# Altium schematic sheet 24V_Main_Regulator.SchDoc (part 4 of 5)
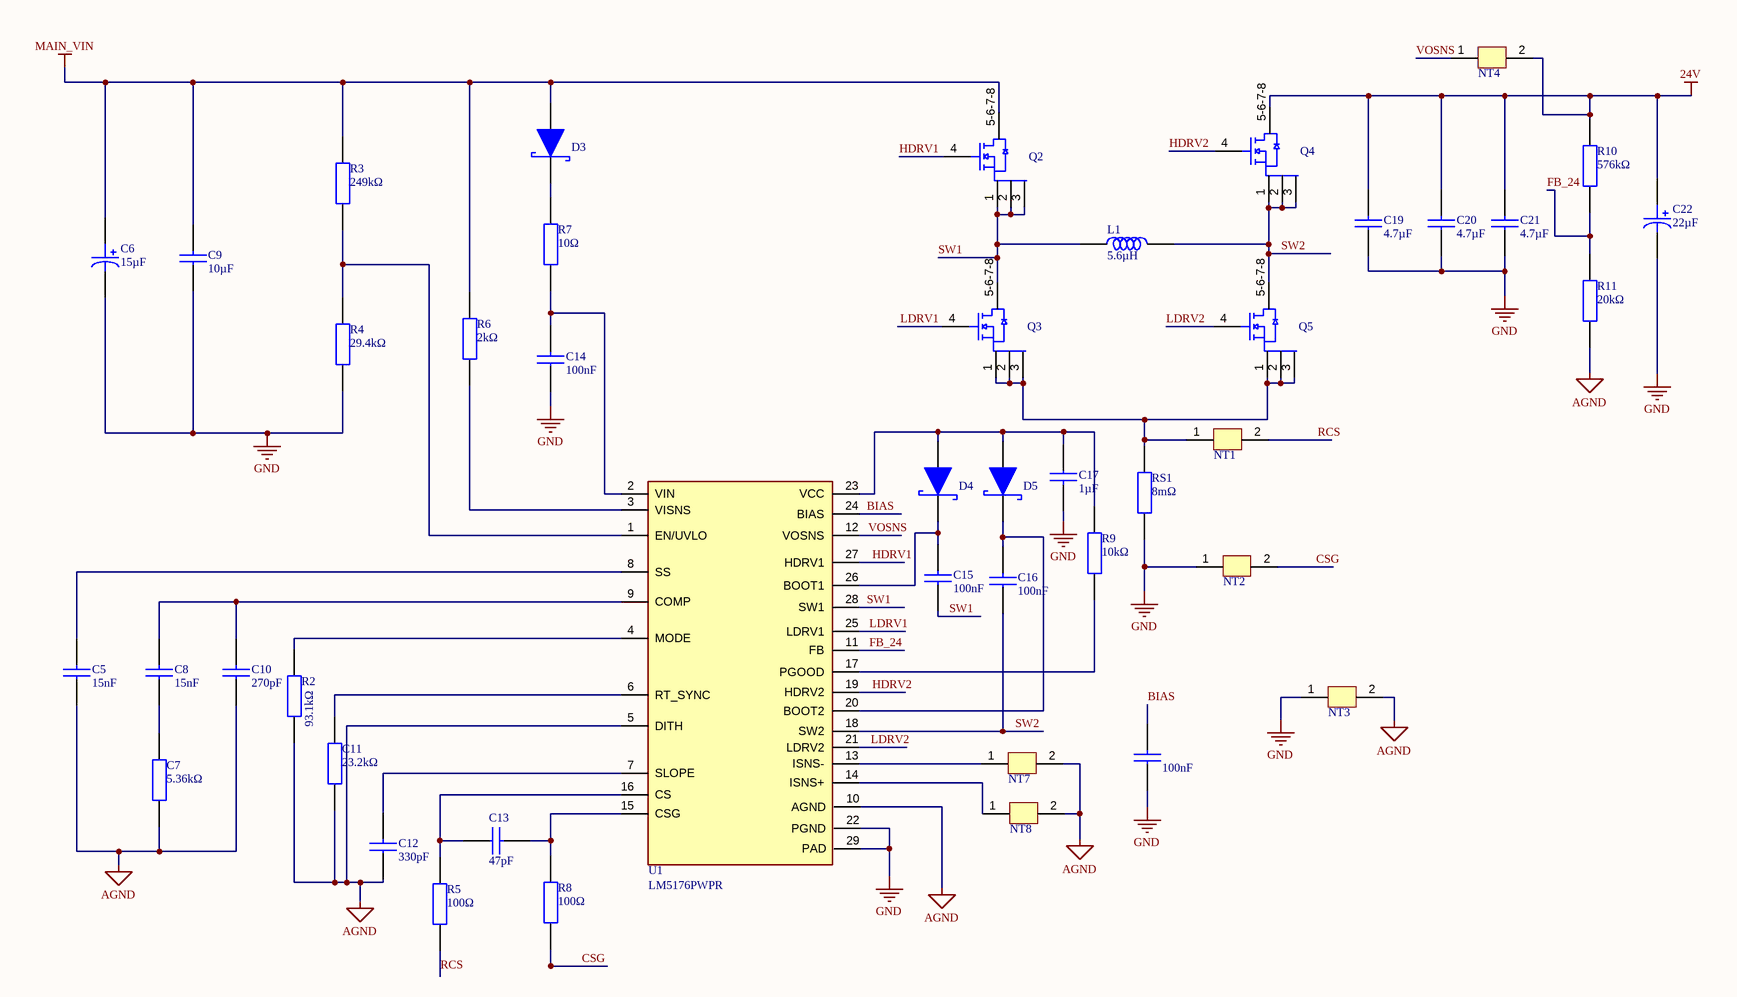
[diagram p3: 24V_Main_Regulator.SchDoc]

## Library data of the parts (continued)
Q4 = CSD18540Q5B: 60-V, N channel NexFET™ power MOSFET, single SON 5 mm x 6 mm, 2.2 mOhm 8-VSON-CLIP -55 to 175; Manufacturer: Texas Instruments; Manufacturer Lifecycle Status: ACTIVE; Continuous Drain Current (ID): 29A; Drain to Source Resistance: 1.8mΩ; Drain to Source Voltage (Vdss): 60V; Fall Time: 3ns; Gate to Source Voltage (Vgs): 20V; Input Capacitance: 4.23nF; Max Junction Temperature (Tj): 175°C; Max Power Dissipation: 3.1W; Number of Channels: 1; Power Dissipation: 3.8W; Rds On Max: 2.2mΩ; Rise Time: 9ns; Turn-Off Delay Time: 20ns; Turn-On Delay Time: 6ns; Supplier: Arrow Electronics; Supplier Part Number: CSD18540Q5B; Manufacturer Part Number: CSD18540Q5B; RoHS: Compliant; Category: MOSFETs; Stock: 867; Pricing: 1=2,6866, 10=1,8382, 25=1,8215, 100=1,293, 250=1,2821, 500=1,0204 (USD); Contact Plating: Gold; Element Configuration: Single; Height: 0m; Lead Free: Contains Lead; Length: 5mm; Lifecycle Status: Production; Max Operating Temperature: 175°C; Min Operating Temperature: -55°C; Mounting Technology: Surface Mount; Pins: 8; Packaging: Tape & Reel (TR); Schedule B: 8541290080, 8541290080|8541290080|8541290080|8541290080|8541290080; Thickness: 950µm; Width: 5mm; ComponentLink1URL: https://datasheet.octopart.com:443/CSD18540Q5B-Texas-Instruments-datasheet-41215267.pdf?src-supplier=Texas+Instruments; ComponentLink1Description: https://datasheet.octopart.com:443/CSD18540Q5B-Texas-Instruments-datasheet-41215267.pdf?src-supplier=Texas+Instruments; ComponentLink2URL: https://octopart.com:443/opatz8j6/c1?t=SUskelIlBWIo_nWBJiAx1_ldGWU3oeiOn-EJs-5do1YusiS-JDvlKRrouVl-Y20ao-5z_08mEvz_AeJefeF_pOrLs0WfjhDJ2_xgnnOXWDpra4Cd3mKzckoQ6QanCMAXyB-vVCGNjBMeeyDAJ_8AtgWzG5J-VV0M2AC15IA14uOxBYYbIO1uRZi3YsibPr8OpLgj2-g8ey3MShCBBxtcPxAJXU9zClIpSD2jte82BFzbVJ9hhAzdJsrLZ3RNwxiUfmRI5v2vfH2Xq2tWnkVJNmbpw4R6VYt-2jb8TG9SzpqJvWz5ux_mibd2tkPbQSuE4I96mnLqjONPYMf24_myiaENOmBZXsZhO5Lu3rDJDhrEeNYScROBq6ZJRXBJXpuxfZxAZ_Uv9q79&src-supplier=Texas+Instruments; ComponentLink2Description: https://octopart.com:443/opatz8j6/c1?t=SUskelIlBWIo_nWBJiAx1_ldGWU3oeiOn-EJs-5do1YusiS-JDvlKRrouVl-Y20ao-5z_08mEvz_AeJefeF_pOrLs0WfjhDJ2_xgnnOXWDpra4Cd3mKzckoQ6QanCMAXyB-vVCGNjBMeeyDAJ_8AtgWzG5J-VV0M2AC15IA14uOxBYYbIO1uRZi3YsibPr8OpLgj2-g8ey3MShCBBxtcPxAJXU9zClIpSD2jte82BFzbVJ9hhAzdJsrLZ3RNwxiUfmRI5v2vfH2Xq2tWnkVJNmbpw4R6VYt-2jb8TG9SzpqJvWz5ux_mibd2tkPbQSuE4I96mnLqjONPYMf24_myiaENOmBZXsZhO5Lu3rDJDhrEeNYScROBq6ZJRXBJXpuxfZxAZ_Uv9q79&src-supplier=Texas+Instruments; ComponentLink3URL: https://datasheet.octopart.com:443/CSD18540Q5B-Texas-Instruments-datasheet-27303987.pdf?src-supplier=Texas+Instruments; ComponentLink3Description: https://datasheet.octopart.com:443/CSD18540Q5B-Texas-Instruments-datasheet-27303987.pdf?src-supplier=Texas+Instruments; ComponentLink4URL: https://datasheet.octopart.com:443/CSD18540Q5B-Texas-Instruments-datasheet-145028107.pdf?src-supplier=Arrow.cn; ComponentLink4Description: https://datasheet.octopart.com:443/CSD18540Q5B-Texas-Instruments-datasheet-145028107.pdf?src-supplier=Arrow.cn; ComponentLink5URL: http://sigma.octopart.com:80/reach_statement/Texas-Instruments-company-64.pdf?src-supplier=Compliance+Statements; ComponentLink5Description: http://sigma.octopart.com:80/reach_statement/Texas-Instruments-company-64.pdf?src-supplier=Compliance+Statements; ComponentLink6URL: http://sigma.octopart.com:80/conflict_mineral_statement/Texas-Instruments-company-63.pdf?src-supplier=Compliance+Statements; ComponentLink6Description: http://sigma.octopart.com:80/conflict_mineral_statement/Texas-Instruments-company-63.pdf?src-supplier=Compliance+Statements
Q5 = CSD18531Q5A: 60-V, N channel NexFET™ power MOSFET, single SON 5 mm x 6 mm, 4.6 mOhm 8-VSONP -55 to 150; Manufacturer: Texas Instruments; Manufacturer Part Number: CSD18531Q5AT; Manufacturer Lifecycle Status: ACTIVE; Continuous Drain Current (ID): 19A; Drain to Source Breakdown Voltage: 60V; Drain to Source Resistance: 3.5mΩ; Fall Time: 2.7ns; Gate to Source Voltage (Vgs): 20V; Input Capacitance: 3.84nF; Max Junction Temperature (Tj): 175°C; Max Power Dissipation: 3.1W; Number of Channels: 1; Power Dissipation: 3.8W; Rds On Max: 4.6mΩ; Value: 3.5mΩ; Rise Time: 7.8ns; Turn-Off Delay Time: 20ns; Turn-On Delay Time: 4.4ns; Supplier: Arrow Electronics; Supplier Part Number: CSD18531Q5AT; RoHS: Compliant; Category: MOSFETs; Pricing: 250=0,8338 (USD); Contact Plating: Tin; Drain to Source Voltage (Vdss): 60V; Element Configuration: Single; Height: 1.1mm; Lead Free: Contains Lead; Length: 4.9mm; Lifecycle Status: Production; Max Operating Temperature: 150°C; Min Operating Temperature: -55°C; Mounting Technology: Surface Mount; Pins: 8; Packaging: Tape & Reel (TR); Schedule B: 8541290080, 8541290080|8541290080|8541290080|8541290080|8541290080; Thickness: 1mm; Width: 6mm; ComponentLink1URL: https://sigma.octopart.com:443/184372194/technical_drawing/Texas-Instruments-CSD18531Q5AT.pdf?src-supplier=Texas+Instruments; ComponentLink1Description: https://sigma.octopart.com:443/184372194/technical_drawing/Texas-Instruments-CSD18531Q5AT.pdf?src-supplier=Texas+Instruments; ComponentLink2URL: https://octopart.com:443/opatz8j6/c1?t=W2rgiyD8EjdRm1lOlBGoi7T6EEwWZbXWrvnEMGu-A6b8yCru-_x-ioUheIPm0hxZEgjghIgVtPE7G2yaPvvywfBu5e_gdtPPfVxi3_MN2KaDnaFHT6eOwBCucXVzfSMTayYIqoRMHLEh-JgOuNfv0A0EbM76JoV5YlW5CScQnzkUGicMF0MVaNH8qV9Xa8SEM2jbnuuMLUncsLlJ2Nh_6_HcvYALWEcpw-1ynH0F38U8j3r_BkZDi93FTevgE5QOgVnjDW5Tb2x-_jnB4s8BDtSwP8ocS-5RH8orsDAZrGiujDbFgbWPSiX966ts_AoMkv91lGcKW3xUpcpSdzRQwiT4IIdsP0R0j06tuTnbm32eNkMYCAe8Y2R0e9qZlXzEIumhKZZtVvlT&src-supplier=Texas+Instruments; ComponentLink2Description: https://octopart.com:443/opatz8j6/c1?t=W2rgiyD8EjdRm1lOlBGoi7T6EEwWZbXWrvnEMGu-A6b8yCru-_x-ioUheIPm0hxZEgjghIgVtPE7G2yaPvvywfBu5e_gdtPPfVxi3_MN2KaDnaFHT6eOwBCucXVzfSMTayYIqoRMHLEh-JgOuNfv0A0EbM76JoV5YlW5CScQnzkUGicMF0MVaNH8qV9Xa8SEM2jbnuuMLUncsLlJ2Nh_6_HcvYALWEcpw-1ynH0F38U8j3r_BkZDi93FTevgE5QOgVnjDW5Tb2x-_jnB4s8BDtSwP8ocS-5RH8orsDAZrGiujDbFgbWPSiX966ts_AoMkv91lGcKW3xUpcpSdzRQwiT4IIdsP0R0j06tuTnbm32eNkMYCAe8Y2R0e9qZlXzEIumhKZZtVvlT&src-supplier=Texas+Instruments; ComponentLink3URL: https://sigma.octopart.com:443/183468693/technical_drawing/Texas-Instruments-CSD18531Q5AT.pdf?src-supplier=Texas+Instruments; ComponentLink3Description: https://sigma.octopart.com:443/183468693/technical_drawing/Texas-Instruments-CSD18531Q5AT.pdf?src-supplier=Texas+Instruments; ComponentLink4URL: https://datasheet.octopart.com:443/CSD18531Q5AT-Texas-Instruments-datasheet-41215258.pdf?src-supplier=Texas+Instruments; ComponentLink4Description: https://datasheet.octopart.com:443/CSD18531Q5AT-Texas-Instruments-datasheet-41215258.pdf?src-supplier=Texas+Instruments; ComponentLink5URL: https://datasheet.octopart.com:443/CSD18531Q5AT-Texas-Instruments-datasheet-38229661.pdf?src-supplier=Texas+Instruments; ComponentLink5Description: https://datasheet.octopart.com:443/CSD18531Q5AT-Texas-Instruments-datasheet-38229661.pdf?src-supplier=Texas+Instruments; ComponentLink6URL: https://datasheet.octopart.com:443/CSD18531Q5AT-Texas-Instruments-datasheet-153410981.pdf?src-supplier=Upverter; ComponentLink6Description: https://datasheet.octopart.com:443/CSD18531Q5AT-Texas-Instruments-datasheet-153410981.pdf?src-supplier=Upverter; ComponentLink7URL: https://datasheet.octopart.com:443/CSD18531Q5AT-Texas-Instruments-datasheet-163657923.pdf?src-supplier=Augswan; ComponentLink7Description: https://datasheet.octopart.com:443/CSD18531Q5AT-Texas-Instruments-datasheet-163657923.pdf?src-supplier=Augswan; ComponentLink8URL: https://datasheet.octopart.com:443/CSD18531Q5AT-Texas-Instruments-datasheet-97084065.pdf?src-supplier=TME; ComponentLink8Description: https://datasheet.octopart.com:443/CSD18531Q5AT-Texas-Instruments-datasheet-97084065.pdf?src-supplier=TME; ComponentLink9URL: https://datasheet.octopart.com:443/CSD18531Q5AT-Texas-Instruments-datasheet-140571312.pdf?src-supplier=Arrow.cn; ComponentLink9Description: https://datasheet.octopart.com:443/CSD18531Q5AT-Texas-Instruments-datasheet-140571312.pdf?src-supplier=Arrow.cn; ComponentLink10URL: https://datasheet.octopart.com:443/CSD18531Q5AT-Texas-Instruments-datasheet-62088669.pdf?src-supplier=Newark; ComponentLink10Description: https://datasheet.octopart.com:443/CSD18531Q5AT-Texas-Instruments-datasheet-62088669.pdf?src-supplier=Newark; ComponentLink11URL: https://datasheet.octopart.com:443/CSD18531Q5AT-Texas-Instruments-datasheet-44402567.pdf?src-supplier=Newark; ComponentLink11Description: https://datasheet.octopart.com:443/CSD18531Q5AT-Texas-Instruments-datasheet-44402567.pdf?src-supplier=Newark; ComponentLink12URL: http://sigma.octopart.com:80/reach_statement/Texas-Instruments-company-64.pdf?src-supplier=Compliance+Statements; ComponentLink12Description: http://sigma.octopart.com:80/reach_statement/Texas-Instruments-company-64.pdf?src-supplier=Compliance+Statements; ComponentLink13URL: http://sigma.octopart.com:80/conflict_mineral_statement/Texas-Instruments-company-63.pdf?src-supplier=Compliance+Statements; ComponentLink13Description: http://sigma.octopart.com:80/conflict_mineral_statement/Texas-Instruments-company-63.pdf?src-supplier=Compliance+Statements
R2 = RC0603FR-0793K1L: Res Thick Film 0603 93.1K Ohm 1% 0.1W(1/10W) ±100ppm/C Pad SMD T/R; Manufacturer: Yageo Group; Max Power Dissipation: 100mW; Temperature Coefficient: 100ppm/°C; Voltage Rating: 75V; Voltage Rating (DC): 50V; Supplier: Farnell; Supplier Part Number: RC0603FR-0793K1L; Manufacturer Part Number: RC0603FR-0793K1L; RoHS: Compliant; Category: Chip SMD Resistors; Stock: 4877; Pricing: 10=0,0061, 100=0,0052, 500=0,0049, 1000=0,0046, 2500=0,0036 (EUR); Case/Package: 0603; Case Code (Imperial): 0603; China RoHS: Non-Compliant; Composition: Thick Film; Contact Plating: Tin; Depth: 800µm; Features: Moisture Resistant; Height: 450µm; Lead Free: Lead Free; Length: 1.6mm; Lifecycle Status: Production; Max Operating Temperature: 155°C; Military Standard: Not; Min Operating Temperature: -55°C; Mounting Technology: Surface Mount; Number of Terminals: 2; Number of Terminations: 2; Packaging: Tape & Reel; Power Rating: 100mW; Radiation Hardening: No; REACH SVHC: Yes; Schedule B: 8533210045, 8533210045|8533210045|8533210045|8533210045|8533210045; Termination: SMD/SMT; Tolerance: 1%; Width: 800µm; Working Voltage: 75V; ComponentLink1URL: https://datasheet.octopart.com:443/RC0603FR-0793K1L-Yageo-datasheet-175887523.pdf?src-supplier=Newark; ComponentLink1Description: https://datasheet.octopart.com:443/RC0603FR-0793K1L-Yageo-datasheet-175887523.pdf?src-supplier=Newark; ComponentLink2URL: https://datasheet.octopart.com:443/RC0603FR-0793K1L-Yageo-datasheet-103092701.pdf?src-supplier=Upverter; ComponentLink2Description: https://datasheet.octopart.com:443/RC0603FR-0793K1L-Yageo-datasheet-103092701.pdf?src-supplier=Upverter; ComponentLink3URL: https://datasheet.octopart.com:443/RC0603FR-0793K1L-Yageo-datasheet-8328172.pdf?src-supplier=_legacy+Avnet; ComponentLink3Description: https://datasheet.octopart.com:443/RC0603FR-0793K1L-Yageo-datasheet-8328172.pdf?src-supplier=_legacy+Avnet; ComponentLink4URL: https://datasheet.octopart.com:443/RC0603FR-0793K1L-Yageo-Group-datasheet-176638170.pdf?src-supplier=Future+Electronics; ComponentLink4Description: https://datasheet.octopart.com:443/RC0603FR-0793K1L-Yageo-Group-datasheet-176638170.pdf?src-supplier=Future+Electronics; ComponentLink5URL: https://datasheet.octopart.com:443/RC0603FR-0793K1L-Yageo-datasheet-164759695.pdf?src-supplier=Future+Electronics; ComponentLink5Description: https://datasheet.octopart.com:443/RC0603FR-0793K1L-Yageo-datasheet-164759695.pdf?src-supplier=Future+Electronics; ComponentLink6URL: https://datasheet.octopart.com:443/RC0603FR-0793K1L-Yageo-datasheet-137700087.pdf?src-supplier=Future+Electronics; ComponentLink6Description: https://datasheet.octopart.com:443/RC0603FR-0793K1L-Yageo-datasheet-137700087.pdf?src-supplier=Future+Electronics; ComponentLink7URL: https://datasheet.octopart.com:443/RC0603FR-0793K1L-Yageo-datasheet-15599030.pdf?src-supplier=Future+Electronics; ComponentLink7Description: https://datasheet.octopart.com:443/RC0603FR-0793K1L-Yageo-datasheet-15599030.pdf?src-supplier=Future+Electronics; ComponentLink8URL: https://datasheet.octopart.com:443/RC0603FR-0793K1L-Yageo-datasheet-12596169.pdf?src-supplier=Future+Electronics; ComponentLink8Description: https://datasheet.octopart.com:443/RC0603FR-0793K1L-Yageo-datasheet-12596169.pdf?src-supplier=Future+Electronics; ComponentLink9URL: https://datasheet.octopart.com:443/RC0603FR-0793K1L-Yageo-datasheet-79472498.pdf?src-supplier=Megastar; ComponentLink9Description: https://datasheet.octopart.com:443/RC0603FR-0793K1L-Yageo-datasheet-79472498.pdf?src-supplier=Megastar; ComponentLink10URL: https://datasheet.octopart.com/RC0603FR-0793K1L-Yageo-datasheet-73766026.pdf; ComponentLink10Description: https://datasheet.octopart.com/RC0603FR-0793K1L-Yageo-datasheet-73766026.pdf; ComponentLink11URL: https://datasheet.octopart.com:443/RC0603FR-0793K1L-Yageo-datasheet-118562.pdf?src-supplier=DigiKey; ComponentLink11Description: https://datasheet.octopart.com:443/RC0603FR-0793K1L-Yageo-datasheet-118562.pdf?src-supplier=DigiKey; ComponentLink12URL: http://sigma.octopart.com:80/conflict_mineral_statement/Yageo-company-3.pdf?src-supplier=Compliance+Statements; ComponentLink12Description: http://sigma.octopart.com:80/conflict_mineral_statement/Yageo-company-3.pdf?src-supplier=Compliance+Statements; ComponentLink13URL: http://sigma.octopart.com:80/rohs_statement/Yageo-company-2.pdf?src-supplier=Compliance+Statements; ComponentLink13Description: http://sigma.octopart.com:80/rohs_statement/Yageo-company-2.pdf?src-supplier=Compliance+Statements
R3 = CRCW0402249KFKED: Fixed Resistor, Metal Glaze/Thick Film, 0.063W, 249000ohm, 50V, 1% +/-Tol, Surface Mount, 0402; Manufacturer: Vishay; Max Power Dissipation: 63mW; Temperature Coefficient: 100ppm/°C; Supplier: Farnell; Supplier Part Number: CRCW0402249KFKED; Manufacturer Part Number: CRCW0402249KFKED; RoHS: Compliant; Category: Chip SMD Resistors; Stock: 14076; Pricing: 10=0,02, 100=0,0145, 500=0,0117, 2500=0,0097, 5000=0,0095 (EUR); Case/Package: 0402; Case Code (Imperial): 0402; China RoHS: Non-Compliant; Composition: Thick Film; Contact Plating: Tin; Depth: 500µm; Features: Automotive AEC-Q200; Height: 350µm; Lead Free: Lead Free; Length: 1mm; Lifecycle Status: Production; Max Operating Temperature: 155°C; Military Standard: Not; Min Operating Temperature: -55°C; Mounting Technology: Surface Mount; Pins: 2; Number of Terminals: 2; Number of Terminations: 2; Packaging: Cut Tape; Power Rating: 63mW; Ratings: AEC-Q200; REACH SVHC: Yes; Schedule B: 8533210045, 8533210045|8533210045|8533210045|8533210045|8533210045|8533210045|8533210045|8533210045|8533210045|8533210045|8533210045|8533210045|8533210045|8533210045|8533210045|8533210045|8533210045|8533210045|8533210045|8533210045|8533210045|8533210045|8533210045|85; Termination: SMD/SMT; Tolerance: 1%; Voltage Rating: 50V; Voltage Rating (DC): 50V; Weight: 652.039032µg; Width: 500µm; Working Voltage: 50V; ComponentLink1URL: https://datasheet.octopart.com:443/CRCW0402249KFKED-Vishay-datasheet-175423584.pdf?src-supplier=IHS; ComponentLink1Description: https://datasheet.octopart.com:443/CRCW0402249KFKED-Vishay-datasheet-175423584.pdf?src-supplier=IHS; ComponentLink2URL: https://datasheet.octopart.com:443/CRCW0402249KFKED-Vishay-datasheet-83961561.pdf?src-supplier=element14+APAC; ComponentLink2Description: https://datasheet.octopart.com:443/CRCW0402249KFKED-Vishay-datasheet-83961561.pdf?src-supplier=element14+APAC; ComponentLink3URL: https://datasheet.octopart.com:443/CRCW0402249KFKED-Vishay-datasheet-62317933.pdf?src-supplier=element14+APAC; ComponentLink3Description: https://datasheet.octopart.com:443/CRCW0402249KFKED-Vishay-datasheet-62317933.pdf?src-supplier=element14+APAC; ComponentLink4URL: https://datasheet.octopart.com:443/CRCW0402249KFKED-Vishay-datasheet-14722531.pdf?src-supplier=element14+APAC; ComponentLink4Description: https://datasheet.octopart.com:443/CRCW0402249KFKED-Vishay-datasheet-14722531.pdf?src-supplier=element14+APAC; ComponentLink5URL: https://datasheet.octopart.com:443/CRCW0402249KFKED-Vishay-datasheet-5299586.pdf?src-supplier=element14+APAC; ComponentLink5Description: https://datasheet.octopart.com:443/CRCW0402249KFKED-Vishay-datasheet-5299586.pdf?src-supplier=element14+APAC; ComponentLink6URL: https://datasheet.octopart.com:443/CRCW0402249KFKED-Vishay-datasheet-10380026.pdf?src-supplier=element14+APAC; ComponentLink6Description: https://datasheet.octopart.com:443/CRCW0402249KFKED-Vishay-datasheet-10380026.pdf?src-supplier=element14+APAC; ComponentLink7URL: https://datasheet.octopart.com:443/CRCW0402249KFKED.-Vishay-datasheet-78776209.pdf?src-supplier=Newark; ComponentLink7Description: https://datasheet.octopart.com:443/CRCW0402249KFKED.-Vishay-datasheet-78776209.pdf?src-supplier=Newark; ComponentLink8URL: https://datasheet.octopart.com:443/CRCW0402249KFKED-Vishay-datasheet-66077789.pdf?src-supplier=Newark; ComponentLink8Description: https://datasheet.octopart.com:443/CRCW0402249KFKED-Vishay-datasheet-66077789.pdf?src-supplier=Newark; ComponentLink9URL: https://datasheet.octopart.com:443/CRCW0402249KFKED-Vishay-datasheet-11761042.pdf?src-supplier=Newark; ComponentLink9Description: https://datasheet.octopart.com:443/CRCW0402249KFKED-Vishay-datasheet-11761042.pdf?src-supplier=Newark; ComponentLink10URL: https://datasheet.octopart.com:443/CRCW0402249KFKED-Vishay-datasheet-11516975.pdf?src-supplier=Newark; ComponentLink10Description: https://datasheet.octopart.com:443/CRCW0402249KFKED-Vishay-datasheet-11516975.pdf?src-supplier=Newark; ComponentLink11URL: https://datasheet.octopart.com:443/CRCW0402249KFKED-Vishay-datasheet-159614168.pdf?src-supplier=Newark; ComponentLink11Description: https://datasheet.octopart.com:443/CRCW0402249KFKED-Vishay-datasheet-159614168.pdf?src-supplier=Newark; ComponentLink12URL: https://datasheet.octopart.com:443/CRCW0402249KFKED-Vishay-datasheet-41302739.pdf?src-supplier=Newark; ComponentLink12Description: https://datasheet.octopart.com:443/CRCW0402249KFKED-Vishay-datasheet-41302739.pdf?src-supplier=Newark; ComponentLink13URL: https://datasheet.octopart.com:443/CRCW0402249KFKED-Vishay-datasheet-33013972.pdf?src-supplier=Newark; ComponentLink13Description: https://datasheet.octopart.com:443/CRCW0402249KFKED-Vishay-datasheet-33013972.pdf?src-supplier=Newark; ComponentLink14URL: https://datasheet.octopart.com:443/CRCW0402249KFKED-Vishay-datasheet-21226360.pdf?src-supplier=Newark; ComponentLink14Description: https://datasheet.octopart.com:443/CRCW0402249KFKED-Vishay-datasheet-21226360.pdf?src-supplier=Newark; ComponentLink15URL: https://datasheet.octopart.com:443/CRCW0402249KFKED-Vishay-datasheet-62316122.pdf?src-supplier=Future+Electronics; ComponentLink15Description: https://datasheet.octopart.com:443/CRCW0402249KFKED-Vishay-datasheet-62316122.pdf?src-supplier=Future+Electronics; ComponentLink16URL: https://datasheet.octopart.com:443/CRCW0402249KFKED-Vishay-datasheet-5300368.pdf?src-supplier=Future+Electronics; ComponentLink16Description: https://datasheet.octopart.com:443/CRCW0402249KFKED-Vishay-datasheet-5300368.pdf?src-supplier=Future+Electronics; ComponentLink17URL: https://datasheet.octopart.com:443/CRCW0402249KFKED-Vishay-Dale-datasheet-47688880.pdf?src-supplier=RS+(Formerly+Allied+Electronics); ComponentLink17Description: https://datasheet.octopart.com:443/CRCW0402249KFKED-Vishay-Dale-datasheet-47688880.pdf?src-supplier=RS+(Formerly+Allied+Electronics); ComponentLink18URL: https://datasheet.octopart.com:443/CRCW0402249KFKED-Vishay-datasheet-12001583.pdf?src-supplier=RS+(Formerly+Allied+Electronics); ComponentLink18Description: https://datasheet.octopart.com:443/CRCW0402249KFKED-Vishay-datasheet-12001583.pdf?src-supplier=RS+(Formerly+Allied+Electronics); ComponentLink19URL: https://datasheet.octopart.com:443/CRCW0402249KFKED-Vishay-datasheet-5306405.pdf?src-supplier=RS+(Formerly+Allied+Electronics); ComponentLink19Description: https://datasheet.octopart.com:443/CRCW0402249KFKED-Vishay-datasheet-5306405.pdf?src-supplier=RS+(Formerly+Allied+Electronics); ComponentLink20URL: https://datasheet.octopart.com/D-CRCW-e3-Standard-Thick-Film-Chip-Resistors-Vishay-datasheet-family-64.pdf; ComponentLink20Description: https://datasheet.octopart.com/D-CRCW-e3-Standard-Thick-Film-Chip-Resistors-Vishay-datasheet-family-64.pdf; ComponentLink21URL: https://datasheet.octopart.com:443/CRCW0402249KFKED-Vishay-datasheet-11540273.pdf?src-supplier=Arrow+Electronics; ComponentLink21Description: https://datasheet.octopart.com:443/CRCW0402249KFKED-Vishay-datasheet-11540273.pdf?src-supplier=Arrow+Electronics; ComponentLink22URL: https://datasheet.octopart.com:443/CRCW0402249KFKED-Vishay-datasheet-8445837.pdf?src-supplier=element14; ComponentLink22Description: https://datasheet.octopart.com:443/CRCW0402249KFKED-Vishay-datasheet-8445837.pdf?src-supplier=element14; ComponentLink23URL: https://datasheet.octopart.com:443/CRCW0402249KFKED-Vishay-datasheet-5377255.pdf?src-supplier=Garrett; ComponentLink23Description: https://datasheet.octopart.com:443/CRCW0402249KFKED-Vishay-datasheet-5377255.pdf?src-supplier=Garrett; ComponentLink24URL: https://datasheet.octopart.com:443/CRCW0402249KFKED-Vishay-datasheet-148188.pdf?src-supplier=Garrett; ComponentLink24Description: https://datasheet.octopart.com:443/CRCW0402249KFKED-Vishay-datasheet-148188.pdf?src-supplier=Garrett; ComponentLink25URL: https://datasheet.octopart.com:443/CRCW0402249KFKED-Vishay-datasheet-42367.pdf?src-supplier=Garrett; ComponentLink25Description: https://datasheet.octopart.com:443/CRCW0402249KFKED-Vishay-datasheet-42367.pdf?src-supplier=Garrett; ComponentLink26URL: http://sigma.octopart.com:80/rohs_certificate/D-CRCW-e3-Standard-Thick-Film-Chip-Resistors-Vishay-family-102.pdf?src-supplier=Compliance+Statements; ComponentLink26Description: http://sigma.octopart.com:80/rohs_certificate/D-CRCW-e3-Standard-Thick-Film-Chip-Resistors-Vishay-family-102.pdf?src-supplier=Compliance+Statements
R4 = CRCW040229K4FKED: Res Thick Film 0402 29.4K Ohm 1% 0.063W(1/16W) ±100ppm/C Pad SMD T/R Automotive AEC-Q200; Manufacturer: Vishay; Max Power Dissipation: 63mW; Temperature Coefficient: 100ppm/°C; Voltage Rating: 50V; Supplier: Farnell; Supplier Part Number: CRCW040229K4FKED; Manufacturer Part Number: CRCW040229K4FKED; RoHS: Compliant; Category: Chip SMD Resistors; Stock: 40427; Pricing: 10=0,0198, 100=0,0144, 500=0,0116, 2500=0,0096, 5000=0,0094 (EUR); Case/Package: 0402; Case Code (Imperial): 0402; China RoHS: Non-Compliant; Composition: Thick Film; Contact Plating: Tin; Depth: 500µm; Features: Automotive AEC-Q200; Height: 350µm; Lead Free: Lead Free; Length: 1mm; Lifecycle Status: Production; Max Operating Temperature: 155°C; Military Standard: Not; Min Operating Temperature: -55°C; Mounting Technology: Surface Mount; Pins: 2; Number of Terminals: 2; Number of Terminations: 2; Packaging: Cut Tape; Power Rating: 63mW; Radiation Hardening: No; Ratings: AEC-Q200; REACH SVHC: Yes; Schedule B: 8533210045, 8533210045|8533210045|8533210045|8533210045|8533210045|8533210045|8533210045|8533210045|8533210045|8533210045|8533210045|8533210045|8533210045|8533210045|8533210045|8533210045|8533210045|8533210045|8533210045|8533210045|8533210045|8533210045|8533210045|85; Termination: SMD/SMT; Tolerance: 1%; Voltage Rating (DC): 50V; Weight: 652.039032µg; Width: 500µm; Working Voltage: 50V; ComponentLink1URL: https://datasheet.octopart.com:443/CRCW040229K4FKED-Vishay-datasheet-175423584.pdf?src-supplier=IHS; ComponentLink1Description: https://datasheet.octopart.com:443/CRCW040229K4FKED-Vishay-datasheet-175423584.pdf?src-supplier=IHS; ComponentLink2URL: https://datasheet.octopart.com:443/CRCW040229K4FKED-Vishay-datasheet-83961561.pdf?src-supplier=Newark; ComponentLink2Description: https://datasheet.octopart.com:443/CRCW040229K4FKED-Vishay-datasheet-83961561.pdf?src-supplier=Newark; ComponentLink3URL: https://datasheet.octopart.com:443/CRCW040229K4FKED-Vishay-datasheet-66077789.pdf?src-supplier=Newark; ComponentLink3Description: https://datasheet.octopart.com:443/CRCW040229K4FKED-Vishay-datasheet-66077789.pdf?src-supplier=Newark; ComponentLink4URL: https://datasheet.octopart.com:443/CRCW040229K4FKED-Vishay-datasheet-11761042.pdf?src-supplier=Newark; ComponentLink4Description: https://datasheet.octopart.com:443/CRCW040229K4FKED-Vishay-datasheet-11761042.pdf?src-supplier=Newark; ComponentLink5URL: https://datasheet.octopart.com:443/CRCW040229K4FKED-Vishay-datasheet-41302739.pdf?src-supplier=Newark; ComponentLink5Description: https://datasheet.octopart.com:443/CRCW040229K4FKED-Vishay-datasheet-41302739.pdf?src-supplier=Newark; ComponentLink6URL: https://datasheet.octopart.com:443/CRCW040229K4FKED-Vishay-datasheet-33013972.pdf?src-supplier=Newark; ComponentLink6Description: https://datasheet.octopart.com:443/CRCW040229K4FKED-Vishay-datasheet-33013972.pdf?src-supplier=Newark; ComponentLink7URL: https://datasheet.octopart.com:443/CRCW040229K4FKED-Vishay-datasheet-21226360.pdf?src-supplier=Newark; ComponentLink7Description: https://datasheet.octopart.com:443/CRCW040229K4FKED-Vishay-datasheet-21226360.pdf?src-supplier=Newark; ComponentLink8URL: https://datasheet.octopart.com:443/CRCW040229K4FKED-Vishay-datasheet-62317936.pdf?src-supplier=element14+APAC; ComponentLink8Description: https://datasheet.octopart.com:443/CRCW040229K4FKED-Vishay-datasheet-62317936.pdf?src-supplier=element14+APAC; ComponentLink9URL: https://datasheet.octopart.com:443/CRCW040229K4FKED.-Vishay-datasheet-78776211.pdf?src-supplier=element14+APAC; ComponentLink9Description: https://datasheet.octopart.com:443/CRCW040229K4FKED.-Vishay-datasheet-78776211.pdf?src-supplier=element14+APAC; ComponentLink10URL: https://datasheet.octopart.com:443/CRCW040229K4FKED-Vishay-datasheet-14722531.pdf?src-supplier=element14+APAC; ComponentLink10Description: https://datasheet.octopart.com:443/CRCW040229K4FKED-Vishay-datasheet-14722531.pdf?src-supplier=element14+APAC; ComponentLink11URL: https://datasheet.octopart.com:443/CRCW040229K4FKED-Vishay-datasheet-5299586.pdf?src-supplier=element14+APAC; ComponentLink11Description: https://datasheet.octopart.com:443/CRCW040229K4FKED-Vishay-datasheet-5299586.pdf?src-supplier=element14+APAC; ComponentLink12URL: https://datasheet.octopart.com:443/CRCW040229K4FKED-Vishay-datasheet-10380026.pdf?src-supplier=element14+APAC; ComponentLink12Description: https://datasheet.octopart.com:443/CRCW040229K4FKED-Vishay-datasheet-10380026.pdf?src-supplier=element14+APAC; ComponentLink13URL: https://datasheet.octopart.com:443/CRCW040229K4FKED-Vishay-datasheet-62316122.pdf?src-supplier=Future+Electronics; ComponentLink13Description: https://datasheet.octopart.com:443/CRCW040229K4FKED-Vishay-datasheet-62316122.pdf?src-supplier=Future+Electronics; ComponentLink14URL: https://datasheet.octopart.com:443/CRCW040229K4FKED-Vishay-datasheet-12519820.pdf?src-supplier=Future+Electronics; ComponentLink14Description: https://datasheet.octopart.com:443/CRCW040229K4FKED-Vishay-datasheet-12519820.pdf?src-supplier=Future+Electronics; ComponentLink15URL: https://datasheet.octopart.com:443/CRCW040229K4FKED-Vishay-Dale-datasheet-47688880.pdf?src-supplier=RS+(Formerly+Allied+Electronics); ComponentLink15Description: https://datasheet.octopart.com:443/CRCW040229K4FKED-Vishay-Dale-datasheet-47688880.pdf?src-supplier=RS+(Formerly+Allied+Electronics); ComponentLink16URL: https://datasheet.octopart.com:443/CRCW040229K4FKED-Vishay-datasheet-12001583.pdf?src-supplier=RS+(Formerly+Allied+Electronics); ComponentLink16Description: https://datasheet.octopart.com:443/CRCW040229K4FKED-Vishay-datasheet-12001583.pdf?src-supplier=RS+(Formerly+Allied+Electronics); ComponentLink17URL: https://datasheet.octopart.com:443/CRCW040229K4FKED-Vishay-datasheet-5306405.pdf?src-supplier=RS+(Formerly+Allied+Electronics); ComponentLink17Description: https://datasheet.octopart.com:443/CRCW040229K4FKED-Vishay-datasheet-5306405.pdf?src-supplier=RS+(Formerly+Allied+Electronics); ComponentLink18URL: https://datasheet.octopart.com:443/CRCW040229K4FKED-Vishay-datasheet-11516975.pdf?src-supplier=Farnell; ComponentLink18Description: https://datasheet.octopart.com:443/CRCW040229K4FKED-Vishay-datasheet-11516975.pdf?src-supplier=Farnell; ComponentLink19URL: https://datasheet.octopart.com:443/CRCW040229K4FKED-Vishay-datasheet-8445837.pdf?src-supplier=element14; ComponentLink19Description: https://datasheet.octopart.com:443/CRCW040229K4FKED-Vishay-datasheet-8445837.pdf?src-supplier=element14; ComponentLink20URL: https://datasheet.octopart.com:443/CRCW040229K4FKED-Vishay-datasheet-5377255.pdf?src-supplier=Garrett; ComponentLink20Description: https://datasheet.octopart.com:443/CRCW040229K4FKED-Vishay-datasheet-5377255.pdf?src-supplier=Garrett; ComponentLink21URL: https://datasheet.octopart.com:443/CRCW040229K4FKED-Vishay-datasheet-148188.pdf?src-supplier=Garrett; ComponentLink21Description: https://datasheet.octopart.com:443/CRCW040229K4FKED-Vishay-datasheet-148188.pdf?src-supplier=Garrett; ComponentLink22URL: https://datasheet.octopart.com:443/CRCW040229K4FKED-Vishay-datasheet-42367.pdf?src-supplier=Garrett; ComponentLink22Description: https://datasheet.octopart.com:443/CRCW040229K4FKED-Vishay-datasheet-42367.pdf?src-supplier=Garrett; ComponentLink23URL: http://sigma.octopart.com:80/rohs_statement/Vishay-company-15.pdf?src-supplier=Compliance+Statements; ComponentLink23Description: http://sigma.octopart.com:80/rohs_statement/Vishay-company-15.pdf?src-supplier=Compliance+Statements
R5 R8 = CRCW0603100RFKEA: Res Thick Film 0603 100 Ohm 1% 0.1W(1/10W) ±100ppm/°C Pad SMD T/R Automotive AEC-Q200; Manufacturer: Vishay; Max Power Dissipation: 100mW; Voltage Rating: 75V; Supplier: Farnell; Supplier Part Number: CRCW0603100RFKEA; Manufacturer Part Number: CRCW0603100RFKEA; RoHS: Compliant; Category: Chip SMD Resistors; Stock: 1078795; Pricing: 10=0,0198, 100=0,0144, 500=0,0116, 1000=0,0106, 2500=0,0096 (EUR); Case/Package: 0603; Case Code (Imperial): 0603; China RoHS: Non-Compliant; Composition: Thick Film; Contact Plating: Tin; Country of Origin: Israel, Taiwan; Depth: 850µm; Export Control Classification Number (ECCN) Code: EAR99; Features: Automotive AEC-Q200; Height: 450µm; Harmonized Tariff Schedule (HTS) Code: 8533.21.00.30; Introduction Date: 2005-02-16; Lead Free: Lead Free; Length: 1.55mm; Lifecycle Status: Production; Max Operating Temperature: 155°C; Military Standard: Not; Min Operating Temperature: -55°C; Mounting Technology: Surface Mount; Pins: 2; Number of Terminals: 2; Number of Terminations: 2; Packaging: Cut Tape; Power Rating: 100mW; Radiation Hardening: No; Ratings: AEC-Q200; REACH SVHC: Yes; Schedule B: 8533210045; Temperature Coefficient: 100ppm/°C; Termination: SMD/SMT; Tolerance: 1%; Voltage Rating (DC): 75V; Weight: 2.012816mg; Width: 850µm; Working Voltage: 75V; ComponentLink1URL: https://datasheet.octopart.com:443/CRCW0603100RFKEA-Vishay-datasheet-175423584.pdf?src-supplier=Newark; ComponentLink1Description: https://datasheet.octopart.com:443/CRCW0603100RFKEA-Vishay-datasheet-175423584.pdf?src-supplier=Newark; ComponentLink2URL: https://datasheet.octopart.com:443/CRCW0603100RFKEA-Vishay-datasheet-14722531.pdf?src-supplier=Newark; ComponentLink2Description: https://datasheet.octopart.com:443/CRCW0603100RFKEA-Vishay-datasheet-14722531.pdf?src-supplier=Newark; ComponentLink3URL: https://datasheet.octopart.com:443/CRCW0603100RFKEA-Vishay-datasheet-11516975.pdf?src-supplier=Newark; ComponentLink3Description: https://datasheet.octopart.com:443/CRCW0603100RFKEA-Vishay-datasheet-11516975.pdf?src-supplier=Newark; ComponentLink4URL: https://datasheet.octopart.com:443/CRCW0603100RFKEA-Vishay-datasheet-41302739.pdf?src-supplier=Newark; ComponentLink4Description: https://datasheet.octopart.com:443/CRCW0603100RFKEA-Vishay-datasheet-41302739.pdf?src-supplier=Newark; ComponentLink5URL: https://datasheet.octopart.com:443/CRCW0603100RFKEA-Vishay-datasheet-33013972.pdf?src-supplier=Newark; ComponentLink5Description: https://datasheet.octopart.com:443/CRCW0603100RFKEA-Vishay-datasheet-33013972.pdf?src-supplier=Newark; ComponentLink6URL: https://datasheet.octopart.com:443/CRCW0603100RFKEA-Vishay-datasheet-21226360.pdf?src-supplier=Newark; ComponentLink6Description: https://datasheet.octopart.com:443/CRCW0603100RFKEA-Vishay-datasheet-21226360.pdf?src-supplier=Newark; ComponentLink7URL: https://datasheet.octopart.com:443/CRCW0603100RFKEA-Vishay-datasheet-62316122.pdf?src-supplier=Future+Electronics; ComponentLink7Description: https://datasheet.octopart.com:443/CRCW0603100RFKEA-Vishay-datasheet-62316122.pdf?src-supplier=Future+Electronics; ComponentLink8URL: https://datasheet.octopart.com:443/CRCW0603100RFKEA-Vishay-datasheet-5300368.pdf?src-supplier=Future+Electronics; ComponentLink8Description: https://datasheet.octopart.com:443/CRCW0603100RFKEA-Vishay-datasheet-5300368.pdf?src-supplier=Future+Electronics; ComponentLink9URL: https://datasheet.octopart.com:443/CRCW0603100RFKEA-Vishay-datasheet-83961561.pdf?src-supplier=element14+APAC; ComponentLink9Description: https://datasheet.octopart.com:443/CRCW0603100RFKEA-Vishay-datasheet-83961561.pdf?src-supplier=element14+APAC; ComponentLink10URL: https://datasheet.octopart.com:443/CRCW0603100RFKEA-Vishay-datasheet-62317933.pdf?src-supplier=element14+APAC; ComponentLink10Description: https://datasheet.octopart.com:443/CRCW0603100RFKEA-Vishay-datasheet-62317933.pdf?src-supplier=element14+APAC; ComponentLink11URL: https://datasheet.octopart.com:443/CRCW0603100RFKEA-Vishay-datasheet-16179825.pdf?src-supplier=element14+APAC; ComponentLink11Description: https://datasheet.octopart.com:443/CRCW0603100RFKEA-Vishay-datasheet-16179825.pdf?src-supplier=element14+APAC; ComponentLink12URL: https://datasheet.octopart.com:443/CRCW0603100RFKEA-Vishay-datasheet-66077789.pdf?src-supplier=element14+APAC; ComponentLink12Description: https://datasheet.octopart.com:443/CRCW0603100RFKEA-Vishay-datasheet-66077789.pdf?src-supplier=element14+APAC; ComponentLink13URL: https://datasheet.octopart.com:443/CRCW0603100RFKEA-Vishay-datasheet-5306405.pdf?src-supplier=RS+(Formerly+Allied+Electronics); ComponentLink13Description: https://datasheet.octopart.com:443/CRCW0603100RFKEA-Vishay-datasheet-5306405.pdf?src-supplier=RS+(Formerly+Allied+Electronics); ComponentLink14URL: https://datasheet.octopart.com:443/CRCW0603100RFKEA-Vishay-Dale-datasheet-47688880.pdf?src-supplier=RS+(Formerly+Allied+Electronics); ComponentLink14Description: https://datasheet.octopart.com:443/CRCW0603100RFKEA-Vishay-Dale-datasheet-47688880.pdf?src-supplier=RS+(Formerly+Allied+Electronics); ComponentLink15URL: https://datasheet.octopart.com:443/CRCW0603100RFKEA-Vishay-datasheet-12001583.pdf?src-supplier=RS+(Formerly+Allied+Electronics); ComponentLink15Description: https://datasheet.octopart.com:443/CRCW0603100RFKEA-Vishay-datasheet-12001583.pdf?src-supplier=RS+(Formerly+Allied+Electronics); ComponentLink16URL: https://datasheet.octopart.com:443/CRCW0603100RFKEA-Vishay-datasheet-192322423.pdf?src-supplier=HQonline; ComponentLink16Description: https://datasheet.octopart.com:443/CRCW0603100RFKEA-Vishay-datasheet-192322423.pdf?src-supplier=HQonline; ComponentLink17URL: https://datasheet.octopart.com:443/CRCW0603100RFKEA-Vishay-datasheet-137113732.pdf?src-supplier=X-ON; ComponentLink17Description: https://datasheet.octopart.com:443/CRCW0603100RFKEA-Vishay-datasheet-137113732.pdf?src-supplier=X-ON; ComponentLink18URL: https://datasheet.octopart.com:443/CRCW0603100RFKEA-Vishay-datasheet-17834126.pdf?src-supplier=TME; ComponentLink18Description: https://datasheet.octopart.com:443/CRCW0603100RFKEA-Vishay-datasheet-17834126.pdf?src-supplier=TME; ComponentLink19URL: https://datasheet.octopart.com/D-CRCW-e3-Standard-Thick-Film-Chip-Resistors-Vishay-datasheet-family-64.pdf; ComponentLink19Description: https://datasheet.octopart.com/D-CRCW-e3-Standard-Thick-Film-Chip-Resistors-Vishay-datasheet-family-64.pdf; ComponentLink20URL: https://datasheet.octopart.com:443/CRCW0603100RFKEA-Vishay-datasheet-13242068.pdf?src-supplier=Farnell; ComponentLink20Description: https://datasheet.octopart.com:443/CRCW0603100RFKEA-Vishay-datasheet-13242068.pdf?src-supplier=Farnell; ComponentLink21URL: https://datasheet.octopart.com:443/CRCW0603100RFKEA-Vishay-datasheet-13195083.pdf?src-supplier=Farnell; ComponentLink21Description: https://datasheet.octopart.com:443/CRCW0603100RFKEA-Vishay-datasheet-13195083.pdf?src-supplier=Farnell; ComponentLink22URL: https://datasheet.octopart.com:443/CRCW0603100RFKEA-Vishay-datasheet-13034211.pdf?src-supplier=Farnell; ComponentLink22Description: https://datasheet.octopart.com:443/CRCW0603100RFKEA-Vishay-datasheet-13034211.pdf?src-supplier=Farnell; ComponentLink23URL: https://datasheet.octopart.com:443/CRCW0603100RFKEA-Vishay-datasheet-12600034.pdf?src-supplier=Farnell; ComponentLink23Description: https://datasheet.octopart.com:443/CRCW0603100RFKEA-Vishay-datasheet-12600034.pdf?src-supplier=Farnell; ComponentLink24URL: https://datasheet.octopart.com:443/CRCW0603100RFKEA-Vishay-datasheet-12532161.pdf?src-supplier=Farnell; ComponentLink24Description: https://datasheet.octopart.com:443/CRCW0603100RFKEA-Vishay-datasheet-12532161.pdf?src-supplier=Farnell; ComponentLink25URL: https://datasheet.octopart.com:443/CRCW0603100RFKEA-Vishay-datasheet-12517896.pdf?src-supplier=Farnell; ComponentLink25Description: https://datasheet.octopart.com:443/CRCW0603100RFKEA-Vishay-datasheet-12517896.pdf?src-supplier=Farnell; ComponentLink26URL: https://datasheet.octopart.com:443/CRCW0603100RFKEA-Vishay-datasheet-12509762.pdf?src-supplier=Farnell; ComponentLink26Description: https://datasheet.octopart.com:443/CRCW0603100RFKEA-Vishay-datasheet-12509762.pdf?src-supplier=Farnell; ComponentLink27URL: https://datasheet.octopart.com:443/CRCW0603100RFKEA-Vishay-datasheet-10322335.pdf?src-supplier=Farnell; ComponentLink27Description: https://datasheet.octopart.com:443/CRCW0603100RFKEA-Vishay-datasheet-10322335.pdf?src-supplier=Farnell; ComponentLink28URL: https://datasheet.octopart.com:443/CRCW0603100RFKEA-Vishay-datasheet-8788789.pdf?src-supplier=Farnell; ComponentLink28Description: https://datasheet.octopart.com:443/CRCW0603100RFKEA-Vishay-datasheet-8788789.pdf?src-supplier=Farnell; ComponentLink29URL: https://datasheet.octopart.com:443/CRCW0603100RFKEA-Vishay-datasheet-8361388.pdf?src-supplier=Farnell; ComponentLink29Description: https://datasheet.octopart.com:443/CRCW0603100RFKEA-Vishay-datasheet-8361388.pdf?src-supplier=Farnell; ComponentLink30URL: https://datasheet.octopart.com:443/CRCW0603100RFKEA-Vishay-datasheet-546287.pdf?src-supplier=Farnell; ComponentLink30Description: https://datasheet.octopart.com:443/CRCW0603100RFKEA-Vishay-datasheet-546287.pdf?src-supplier=Farnell; ComponentLink31URL: https://datasheet.octopart.com:443/CRCW0603100RFKEA-Vishay-datasheet-11540273.pdf?src-supplier=Arrow+Electronics; ComponentLink31Description: https://datasheet.octopart.com:443/CRCW0603100RFKEA-Vishay-datasheet-11540273.pdf?src-supplier=Arrow+Electronics; ComponentLink32URL: https://datasheet.octopart.com:443/CRCW0603100RFKEA-Vishay-datasheet-8445837.pdf?src-supplier=element14; ComponentLink32Description: https://datasheet.octopart.com:443/CRCW0603100RFKEA-Vishay-datasheet-8445837.pdf?src-supplier=element14; ComponentLink33URL: https://datasheet.octopart.com:443/CRCW0603100RFKEA-Vishay-datasheet-5377433.pdf?src-supplier=Garrett; ComponentLink33Description: https://datasheet.octopart.com:443/CRCW0603100RFKEA-Vishay-datasheet-5377433.pdf?src-supplier=Garrett; ComponentLink34URL: https://datasheet.octopart.com:443/CRCW0603100RFKEA-Vishay-datasheet-148188.pdf?src-supplier=Garrett; ComponentLink34Description: https://datasheet.octopart.com:443/CRCW0603100RFKEA-Vishay-datasheet-148188.pdf?src-supplier=Garrett; ComponentLink35URL: https://datasheet.octopart.com:443/CRCW0603100RFKEA-Vishay-datasheet-30224.pdf?src-supplier=Garrett; ComponentLink35Description: https://datasheet.octopart.com:443/CRCW0603100RFKEA-Vishay-datasheet-30224.pdf?src-supplier=Garrett; ComponentLink36URL: http://sigma.octopart.com:80/rohs_certificate/D-CRCW-e3-Standard-Thick-Film-Chip-Resistors-Vishay-family-102.pdf?src-supplier=Compliance+Statements; ComponentLink36Description: http://sigma.octopart.com:80/rohs_certificate/D-CRCW-e3-Standard-Thick-Film-Chip-Resistors-Vishay-family-102.pdf?src-supplier=Compliance+Statements